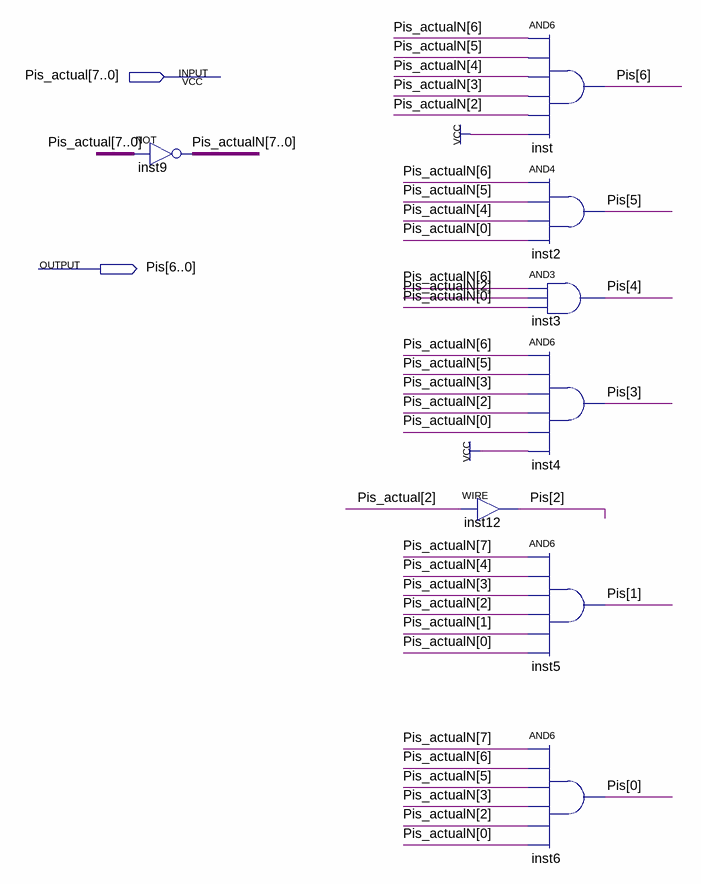
[diagram p0: schematic sheet]
// Quartus schematic Display.bdf as structural Verilog: 8 symbols, 2 pins
module Display (
  input  [7:0] Pis_actual,
  output [6:0] Pis
);

  wire [7:0] Pis_actualN;

  assign Pis_actualN = ~Pis_actual;  // NOT inst9, 8 bits wide
  assign Pis[2] = Pis_actual[2];  // WIRE inst12
  and inst (Pis[6], Pis_actualN[6], Pis_actualN[5], Pis_actualN[4], Pis_actualN[3], Pis_actualN[2], 1'b1);
  and inst2 (Pis[5], Pis_actualN[6], Pis_actualN[5], Pis_actualN[4], Pis_actualN[0]);
  and inst3 (Pis[4], Pis_actualN[6], Pis_actualN[2], Pis_actualN[0]);
  and inst4 (Pis[3], Pis_actualN[6], Pis_actualN[5], Pis_actualN[3], Pis_actualN[2], Pis_actualN[0], 1'b1);
  and inst5 (Pis[1], Pis_actualN[7], Pis_actualN[4], Pis_actualN[3], Pis_actualN[2], Pis_actualN[1], Pis_actualN[0]);
  and inst6 (Pis[0], Pis_actualN[7], Pis_actualN[6], Pis_actualN[5], Pis_actualN[3], Pis_actualN[2], Pis_actualN[0]);
endmodule
